# EAGLE schematic OSSI-1 LED Controller (EAGLE 6.5.0)

## Sheet 1 of 2
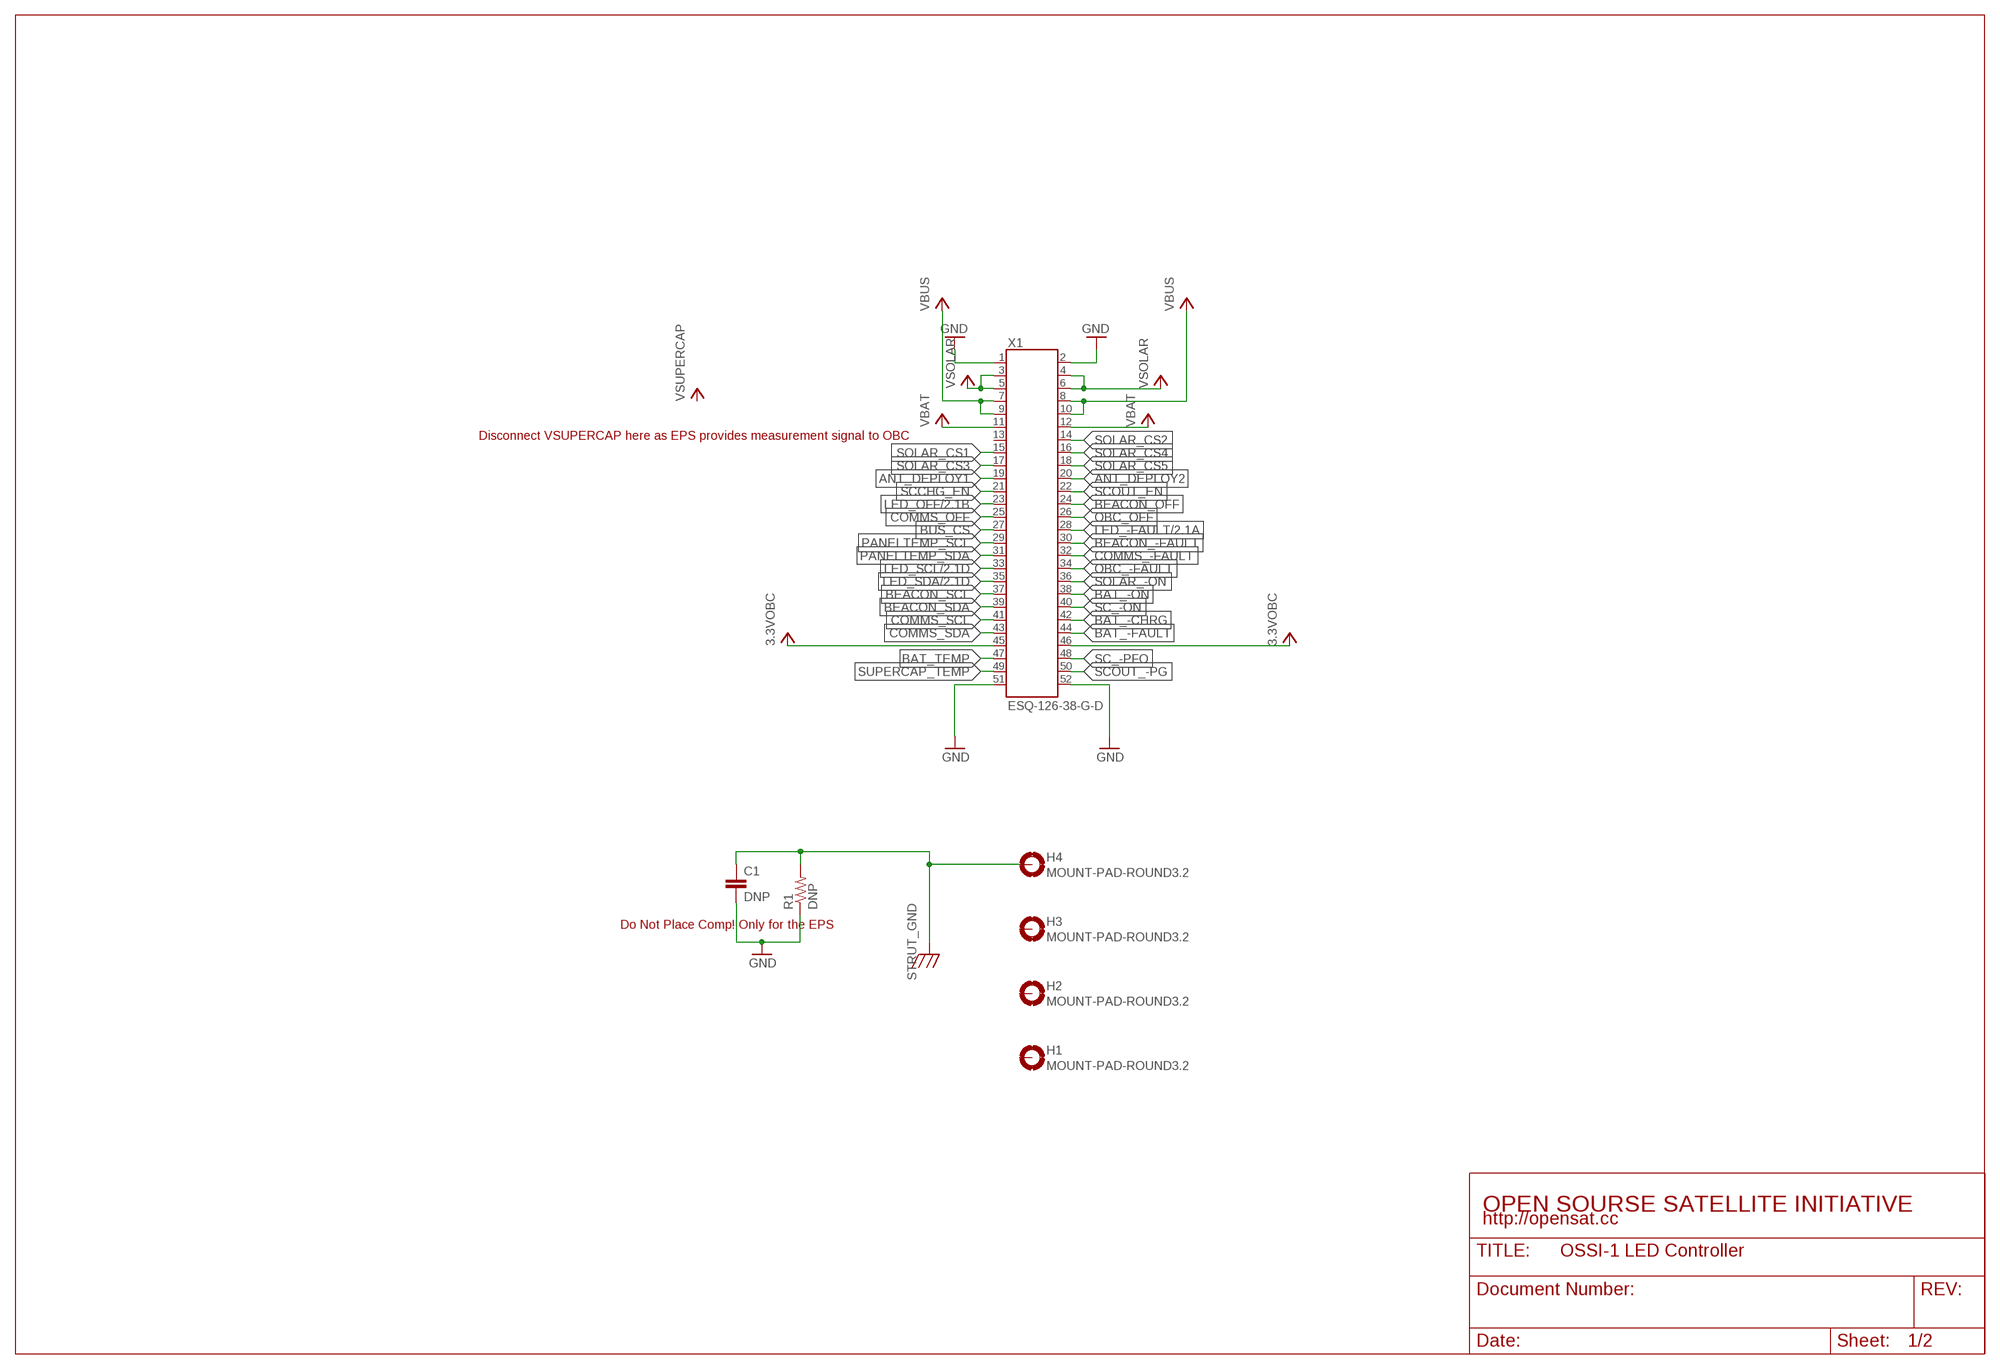
[diagram p0: schematic, sheet 1]

### Parts
C1  DNP  C0805(2012)  [C0805(2012)]
H1  MOUNT-PAD-ROUND3.2  [3.2-PAD-ROUND]
H2  MOUNT-PAD-ROUND3.2  [3.2-PAD-ROUND]
H3  MOUNT-PAD-ROUND3.2  [3.2-PAD-ROUND]
H4  MOUNT-PAD-ROUND3.2  [3.2-PAD-ROUND]
R1  DNP  RWSL1206  [WSL1206]
X1  ESQ-126-38-G-D  [ESQ-126-XX-X-D]

### Nets
3.3VOBC: X1.45 X1.46
ANT_DEPLOY1: X1.19
ANT_DEPLOY2: X1.20
BAT_-CHRG: X1.42
BAT_-FAULT: X1.44
BAT_-ON: X1.38
BAT_TEMP: X1.47
BEACON_-FAULT: X1.30
BEACON_OFF: X1.24
BEACON_SCL: X1.37
BEACON_SDA: X1.39
BUS_CS: X1.27
COMMS_-FAULT: X1.32
COMMS_OFF: X1.25
COMMS_SCL: X1.41
COMMS_SDA: X1.43
GND: C1.2 R1.P$1 X1.1 X1.2 X1.51 X1.52 ; also sheet 2
LED_-FAULT: X1.28 ; also sheet 2
LED_OFF: X1.23 ; also sheet 2
LED_SCL: X1.33 ; also sheet 2
LED_SDA: X1.35 ; also sheet 2
OBC_-FAULT: X1.34
OBC_OFF: X1.26
PANELTEMP_SCL: X1.29
PANELTEMP_SDA: X1.31
SC_-ON: X1.40
SC_-PFO: X1.48
SCCHG_EN: X1.21
SCOUT_-PG: X1.50
SCOUT_EN: X1.22
SOLAR_-ON: X1.36
SOLAR_CS1: X1.15
SOLAR_CS2: X1.14
SOLAR_CS3: X1.17
SOLAR_CS4: X1.16
SOLAR_CS5: X1.18
STRUT_GND: C1.1 H4.B3,2(MOUNT) R1.P$2
SUPERCAP_TEMP: X1.49
VBAT: X1.11 X1.12
VBUS: X1.7 X1.8 X1.9 X1.10 ; also sheet 2
VSOLAR: X1.3 X1.4 X1.5 X1.6
Unconnected: H1.B3,2(MOUNT) H2.B3,2(MOUNT) H3.B3,2(MOUNT) X1.13

### Notes on the sheet
- Disconnect VSUPERCAP here as EPS provides measurement signal to OBC
- Do Not Place Comp! Only for the EPS
- OPEN SOURSE SATELLITE INITIATIVE
- http://opensat.cc

## Sheet 2 of 2
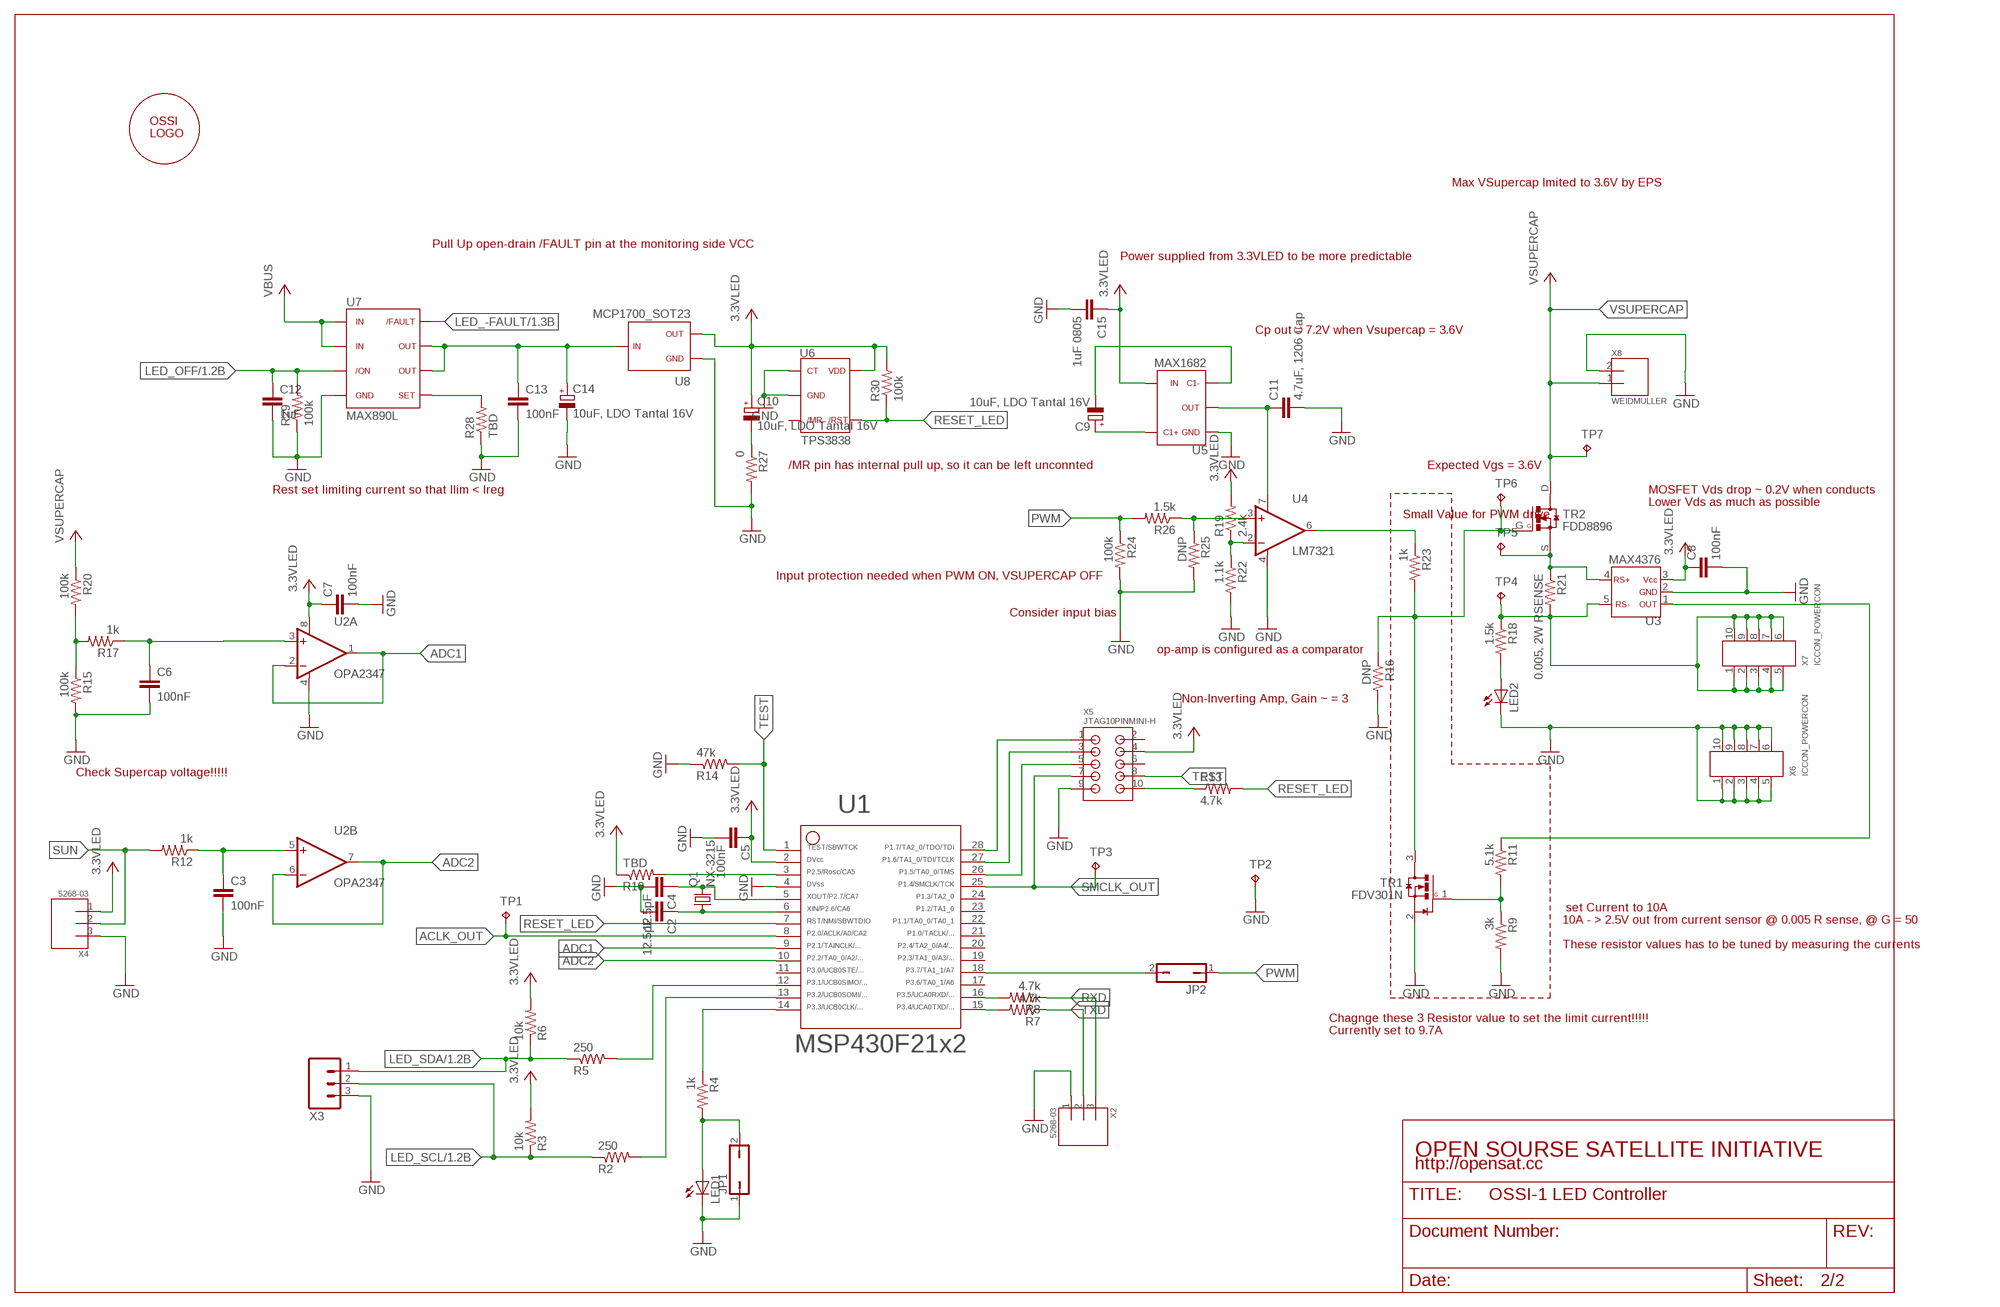
[diagram p1: schematic, sheet 2]

### Parts
C2  12.5pF  C0603(1608)  [C0603(1608)]
C3  100nF  C0603(1608)  [C0603(1608)]
C4  12.5pF  C0603(1608)  [C0603(1608)]
C5  100nF  C0603(1608)  [C0603(1608)]
C6  100nF  C0603(1608)  [C0603(1608)]
C7  100nF  C0603(1608)  [C0603(1608)]
C8  100nF  C0603(1608)  [C0603(1608)]
C9  10uF, LDO Tantal 16V  C-TANTAL-A  [C1206(3216)-A]
C10  10uF, LDO Tantal 16V  C-TANTAL-A  [C1206(3216)-A]
C11  4.7uF, 1206 Cap  C1206(3216)-GCM31  [C1206-GCM31]
C12  1uF  C0603(1608)  [C0603(1608)]
C13  100nF  C0603(1608)  [C0603(1608)]
C14  10uF, LDO Tantal 16V  C-TANTAL-A  [C1206(3216)-A]
C15  1uF 0805  C0805(2012)  [C0805(2012)]
JP1  JP1Q  [JP1]
JP2  JP1Q  [JP1]
LED1  LED0603  [LED-0603]
LED2  LEDCHIPLED_0603  [CHIPLED_0603]
Q1  NX-3215  [NX-3215]
R2  250  R0603(1608)  [R0603(1608)]
R3  10k  R0603(1608)  [R0603(1608)]
R4  1k  R0603(1608)  [R0603(1608)]
R5  250  R0603(1608)  [R0603(1608)]
R6  10k  R0603(1608)  [R0603(1608)]
R7  4.7k  R0603(1608)  [R0603(1608)]
R8  4.7k  R0603(1608)  [R0603(1608)]
R9  3k  R0603(1608)  [R0603(1608)]
R10  TBD  R0603(1608)  [R0603(1608)]
R11  5.1k  R0603(1608)  [R0603(1608)]
R12  1k  R0603(1608)  [R0603(1608)]
R13  4.7k  R0603(1608)  [R0603(1608)]
R14  47k  R0603(1608)  [R0603(1608)]
R15  100k  R0603(1608)  [R0603(1608)]
R16  DNP  R0603(1608)  [R0603(1608)]
R17  1k  R0603(1608)  [R0603(1608)]
R18  1.5k  R0603(1608)  [R0603(1608)]
R19  2.4k  R0603(1608)  [R0603(1608)]
R20  100k  R0603(1608)  [R0603(1608)]
R21  0.005, 2W RSENSE  RWSR2  [R4527(12070)]
R22  1.1k  R0603(1608)  [R0603(1608)]
R23  1k  R0603(1608)  [R0603(1608)]
R24  100k  R0603(1608)  [R0603(1608)]
R25  DNP  R0603(1608)  [R0603(1608)]
R26  1.5k  R0603(1608)  [R0603(1608)]
R27  0  R0603(1608)  [R0603(1608)]
R28  TBD  R0603(1608)  [R0603(1608)]
R29  100k  R0603(1608)  [R0603(1608)]
R30  100k  R0603(1608)  [R0603(1608)]
TP1  TP  [TP-13]
TP2  TP  [TP-13]
TP3  TP  [TP-13]
TP4  TP  [TP-13]
TP5  TP  [TP-13]
TP6  TP  [TP-13]
TP7  TP  [TP-13]
TR1  FDV301N  [SOT23]
TR2  FDD8896  [TO252]
U1  MSP430F2132  [PW28]
U2  OPA2347  [SOT23-8DCN]
U3  MAX4376  [SOT23-5DBV]
U4  LM7321  [SO8]
U5  MAX1682  [SOT23-5DBV]
U6  TPS3838  [SOT23-5DBV]
U7  MAX890L  [SO8]
U8  MCP1700_SOT23  [SOT23]
U$  OSSILOGORECT  [OSSILOGORECT1005]
X2  5268-03  [5268-03]
X3  M03PTH  [1X03]
X4  5268-03  [5268-03]
X5  JTAG10PINMINI-H  [M50-3200545]
X6  ICCON_POWERCON  [ICCON6643220-1]
X7  ICCON_POWERCON  [ICCON6643220-1]
X8  WEIDMULLER  [WEIDMULLER1760490000]

### Nets
3.3VLED: C5.1 C7.1 C8.1 C10.1(+) C15.1 R3.2 R6.2 R10.1 R19.2 R30.2 U1.2 U2.8(A:V+) U3.3 U5.4 U6.5 U8.2 X4.1 X5.4
ACLK_OUT: TP1.TP U1.8
ADC1: U1.9 U2.1(A:OUT) U2.2(A:-IN)
ADC2: U1.10 U2.6(B:-IN) U2.7(B:OUT)
GND: C2.2 C3.2 C4.2 C5.2 C6.2 C7.2 C8.2 C11.P$2 C12.2 C13.2 C14.2(-) C15.2 JP1.1 LED1.C LED2.C R9.2 R14.1 R15.2 R16.2 R22.2 R24.2 R25.2 R27.2 R28.1 R29.1 TP2.TP TR1.2(S) U1.4 U2.4(A:V-) U3.2 U4.4(V-) U5.1 U6.1 U6.2 U7.4 U8.1 X2.1 X3.3 X4.3 X5.9 X6.1 X6.2 X6.3 X6.4 X6.5 X6.6 X6.7 X6.8 X6.9 X6.10 X8.2 ; also sheet 1
LED_-FAULT: U7.8 ; also sheet 1
LED_OFF: C12.1 R29.2 U7.3 ; also sheet 1
LED_SCL: R2.1 R3.1 X3.2 ; also sheet 1
LED_SDA: R5.1 R6.1 X3.1 ; also sheet 1
N$3: U1.28 X5.1
N$4: R10.2 U1.3
N$5: C13.1 C14.1(+) U7.6 U7.7 U8.3
N$6: R16.1 R23.2 TP6.TP TR1.3(D) TR2.G
N$7: C6.1 R17.1 U2.3(A:+IN)
N$8: C3.1 R12.1 U2.5(B:+IN)
N$9: R25.1 R26.1 U4.3(+IN)
N$10: R28.2 U7.5
N$11: R15.1 R17.2 R20.2
N$12: R18.1 R21.P$2 TP4.TP U3.5 X7.1 X7.2 X7.3 X7.4 X7.5 X7.6 X7.7 X7.8 X7.9 X7.10
N$13: C11.P$1 U4.7(V+) U5.2
N$14: R23.1 U4.6(OUT)
N$15: U1.27 X5.3
N$16: R21.P$1 TP5.TP TR2.S U3.4
N$17: C10.2(-) R27.1
N$18: R19.1 R22.1 U4.2(-IN)
N$19: C4.1 Q1.2 U1.5
N$20: C2.1 Q1.1 U1.6
N$21: JP1.2 LED1.A R4.2
N$22: R5.2 U1.12
N$23: R2.2 U1.13
N$24: R11.1 U3.1
N$25: R4.1 U1.14
N$26: C9.2(-) U5.3
N$27: C9.1(+) U5.5
N$28: R8.2 U1.16
N$29: LED2.A R18.2
N$30: R9.1 R11.2 TR1.1(G)
N$31: U1.26 X5.5
N$32: R13.1 X5.10
N$33: JP2.2 U1.18
N$39: R7.2 U1.15
PWM: JP2.1 R24.1 R26.2
RESET_LED: R13.2 R30.1 U1.7 U6.4
RXD: R8.1 X2.3
SMCLK_OUT: TP3.TP U1.25 X5.7
SUN: R12.2 X4.2
TEST: R14.2 U1.1 X5.8
TXD: R7.1 X2.2
VBUS: U7.1 U7.2 ; also sheet 1
VSUPERCAP: R20.1 TP7.TP TR2.D X8.1
Unconnected: U1.11 U1.17 U1.19 U1.20 U1.21 U1.22 U1.23 U1.24 U6.3 X5.2 X5.6

### Notes on the sheet
- Max VSupercap lmited to 3.6V by EPS
- Pull Up open-drain /FAULT pin at the monitoring side VCC
- Power supplied from 3.3VLED to be more predictable
- Cp out = 7.2V when Vsupercap = 3.6V
- /MR pin has internal pull up, so it can be left unconnted | Expected Vgs = 3.6V
- Rest set limiting current so that Ilim < Ireg | MOSFET Vds drop ~ 0.2V when conducts
- Lower Vds as much as possible
- Small Value for PWM drive
- Input protection needed when PWM ON, VSUPERCAP OFF
- Consider input bias
- op-amp is configured as a comparator
- Non-Inverting Amp, Gain ~ = 3
- Check Supercap voltage!!!!!
- set Current to 10A
- 10A - > 2.5V out from current sensor @ 0.005 R sense, @ G = 50
- These resistor values has to be tuned by measuring the currents
- Chagnge these 3 Resistor value to set the limit current!!!!!
- Currently set to 9.7A
- OPEN SOURSE SATELLITE INITIATIVE
- http://opensat.cc

## Library data of the parts
C1-C8 C11-C13 C15 = OSSI:C
C9 C10 C14 = OSSI:C-TANTAL-A: TAJA105M020RNJ Tantal Capacitor Manufacturer: AVX 1206(3126) Ref: www.avx.com/docs/techinfo/tantappl.pdf
H1-H4 = OSSI:MOUNT-PAD-ROUND
JP1 JP2 = OSSI:JP1Q: JUMPER
LED1 = SparkFun:LED: LEDs Standard schematic elements and footprints for 5mm, 3mm, 1206, and 0603 sized LEDs. 5mm - Spark Fun Electronics SKU : COM-00529 (and others)
LED2 = led:LED: LED OSRAM: - CHIPLED LG R971, LG N971, LY N971, LG Q971, LY Q971, LO R971, LY R971 LH N974, LH R974 LS Q976, LO Q976, LY Q976 LO Q996 - Hyper CHIPLED LW Q18S LB Q993, LB Q99A, LB R99A - SideLED LS A670, LO A670, LY A670, LG A670, LP A670 LB A673, LV A673, LT A673, LW A673 LH A674 LY A675 LS A676, LA A676, LO A676, LY A676, LW A676 LS A679, LY A679, LG A679 - Hyper Micro SIDELED® LS Y876, LA Y876, LO Y876, LY Y876 LT Y87S - SmartLED LW L88C, LW L88S LB L89C, LB L89S, LG L890 LS L89K, LO L89K, LY L89K LS L896, LA L896, LO L896, LY L896 - TOPLED LS T670, LO T670, LY T670, LG T670, LP T670 LSG T670, LSP T670, LSY T670, LOP T670, LYG T670 LG T671, LOG T671, LSG T671 LB T673, LV T673, LT T673, LW T673 LH T674 LS T676, LA T676, LO T676, LY T676, LB T676, LH T676, LSB T676, LW T676 LB T67C, LV T67C, LT T67C, LS T67K, LO T67K, LY T67K, LW E67C LS E67B, LA E67B, LO E67B, LY E67B, LB E67C, LV E67C, LT E67C LW T67C LS T679, LY T679, LG T679 LS T770, LO T770, LY T770, LG T770, LP T770 LB T773, LV T773, LT T773, LW T773 LH T774 LS E675, LA E675, LY E675, LS T675 LS T776, LA T776, LO T776, LY T776, LB T776 LHGB T686 LT T68C, LB T68C - Hyper Mini TOPLED® LB M676 - Mini TOPLED Santana® LG M470 LS M47K, LO M47K, LY M47K Source: http://www.osram.convergy.de LUXEON: - LUMILED® LXK2-PW12-R00, LXK2-PW12-S00, LXK2-PW14-U00, LXK2-PW14-V00 LXK2-PM12-R00, LXK2-PM12-S00, LXK2-PM14-U00 LXK2-PE12-Q00, LXK2-PE12-R00, LXK2-PE12-S00, LXK2-PE14-T00, LXK2-PE14-U00 LXK2-PB12-K00, LXK2-PB12-L00, LXK2-PB12-M00, LXK2-PB14-N00, LXK2-PB14-P00, LXK2-PB14-Q00 LXK2-PR12-L00, LXK2-PR12-M00, LXK2-PR14-Q00, LXK2-PR14-R00 LXK2-PD12-Q00, LXK2-PD12-R00, LXK2-PD12-S00 LXK2-PH12-R00, LXK2-PH12-S00 LXK2-PL12-P00, LXK2-PL12-Q00, LXK2-PL12-R00 Source: www.luxeon.com KINGBRIGHT: KA-3528ASYC Source: www.kingbright.com
Q1 = OSSI:NX-3215: NDK 32.768 kHz SMD Crystal P/N: NX3215SA-32.768K-STD-MUA-9 Nominal frequency (kHz): 32.768 Package Size (L×W×H : mm): 3.2×1.5×0.8 Operating Temperature Range(*1) / Storage Temperature Range (°C): -40 to +85 / -40 to +85 Level of drive: 0.1µW (Max. 0.5µW) Frequency Tolerance (25±3°C): ±20×10-6 Load Capacitance: 9.0pF, 12.5pF Equivalent Series Resistance: 70kΩ Max. Ordering Code: NX3215SA-32.768K-STD-MUA-9 (Load Capacitance9.0pF) /NX3215SA-32.768K-STD-MUA-8 (Load Capacitance12.5pF)
R1-R30 = OSSI:R
TP1-TP7 = OSSI:TP
TR1 = OSSI:FDV301N: FDV301N Digital N channel - FET / Rdson = 5 Ohm / Vgs = 0.7~1.06V / Ids = 220mA
TR2 = OSSI:FDD8896: FDD8896 N-Channel PowerTrench ® MOSFET
U1 = OSSI:MSP430F2132: *** MSP430F21x2 *** PW28
U2 = OSSI:OPA2347: OPA2347 RAIL-TO-RAIL INPUT AND OUTPUT SINGLE SUPPLY: 2.3V to 5.5V LOW IQ: 20µ
U3 = OSSI:MAX4376
U4 = OSSI:LM7321: LM7321 Rail-to-Rail Input/Output ±15V, High Output Current and Unlimited Capacitive Load Operational Amplifier Texas Intrument
U5 = OSSI:MAX1682: MAX1682EUK+T Charge Pump
U6 = OSSI:TPS3838: TPS3838 NanoPower Supervisory IC from texas instruments. TPS3838 is open-drain output
U7 = OSSI:MAX890L: MAX 890L 1.2A, Current-Limited, High-Side P-Channel Switch with Thermal Shutdown BY MAXIM
U8 = OSSI:MCP1700: MCP1700 LDO from Microchips
U$ = OSSI:OSSILOGO
X1 = OSSI:ESQ-126-: Samtec ESQ-126-XX-G-D Elevated Sockets Seires ESQ-126-37-G-D ESQ-126-38-G-D ESQ-126-39-G-D
X2 X4 = OSSI:5268-03
X3 = OSSI:M03: Header 3 Standard 3-pin 0.1" header. Use with straight break away headers (SKU : PRT-00116), right angle break away headers (PRT-00553), swiss pins (PRT-00743), machine pins (PRT-00117), and female headers (PRT-00115). Molex polarized connector foot print use with SKU : PRT-08232 with associated crimp pins and housings.
X5 = OSSI:JTAG10PINMINI
X6 X7 = OSSI:ICCON_POWERCON
X8 = OSSI:WEIDMULLER